# Altium schematic sheet MODULE_FPGA.SchDoc
size 420 x 297 mm
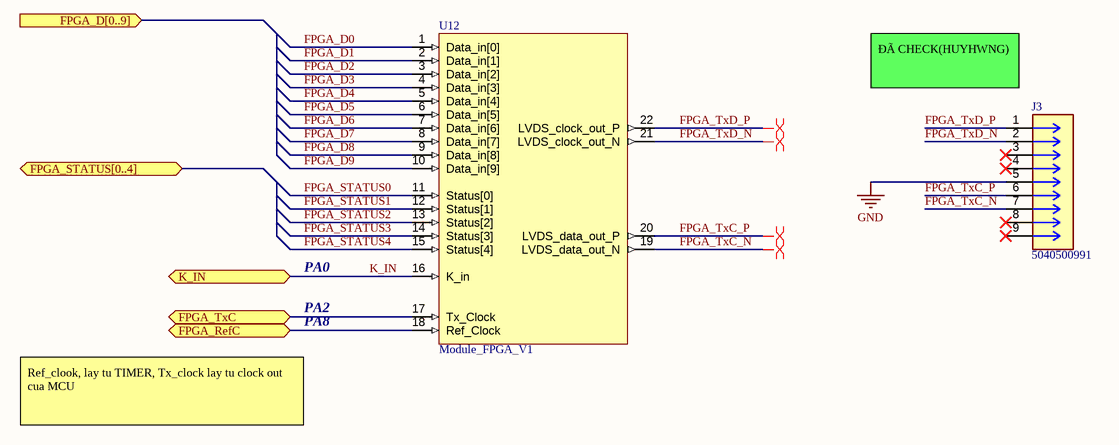
[diagram p0: MODULE_FPGA.SchDoc]

## Parts
J3  5040500991  [5040500991]
U12  Module_FPGA_V1  [MODULE_FPGA]

## Ports
FPGA_D[0..9] (in), FPGA_RefC (bidir), FPGA_STATUS[0..4] (bidir), FPGA_TxC (bidir), K_IN (bidir)

## Nets
GND: J3.5
FPGA_D0: U12.1(Data_in[0])
FPGA_D1: U12.2(Data_in[1])
FPGA_D2: U12.3(Data_in[2])
FPGA_D3: U12.4(Data_in[3])
FPGA_D4: U12.5(Data_in[4])
FPGA_D5: U12.6(Data_in[5])
FPGA_D6: U12.7(Data_in[6])
FPGA_D7: U12.8(Data_in[7])
FPGA_D8: U12.9(Data_in[8])
FPGA_D9: U12.10(Data_in[9])
FPGA_RefC: U12.18(Ref_Clock) ; port FPGA_RefC
FPGA_STATUS0: U12.11(Status[0])
FPGA_STATUS1: U12.12(Status[1])
FPGA_STATUS2: U12.13(Status[2])
FPGA_STATUS3: U12.14(Status[3])
FPGA_STATUS4: U12.15(Status[4])
FPGA_TxC: U12.17(Tx_Clock) ; port FPGA_TxC
FPGA_TxC_N: J3.7 U12.19(LVDS_data_out_N)
FPGA_TxC_P: J3.6 U12.20(LVDS_data_out_P)
FPGA_TxD_N: J3.2 U12.21(LVDS_clock_out_N)
FPGA_TxD_P: J3.1 U12.22(LVDS_clock_out_P)
K_IN: U12.16(K_in) ; port K_IN

Not connected (* = marked no-connect by the designer): J3 3* 4* 8* 9*

## Layout directives
differential pair: FPGA_TxC_N, FPGA_TxC_P, FPGA_TxD_N, FPGA_TxD_P

## Notes on the sheet
- (near J3) ĐÃ CHECK(HUYHWNG)
- PA0
- PA2
- PA8
- Ref_clook, lay tu TIMER, Tx_clock lay tu clock out cua MCU
- Sub-system:
- Design by:
- Sheet title:
- Project:
- Sheet:
- of
- Checked by:
- Approved by:
- Doc no:
- Revision:
- Size:
- Date:

## Library data of the parts
J3 = 5040500991: Connector Header Surface Mount, Right Angle 9 position 0.059" (1.50mm)